# EAGLE design tracker (EAGLE 6.5.0)
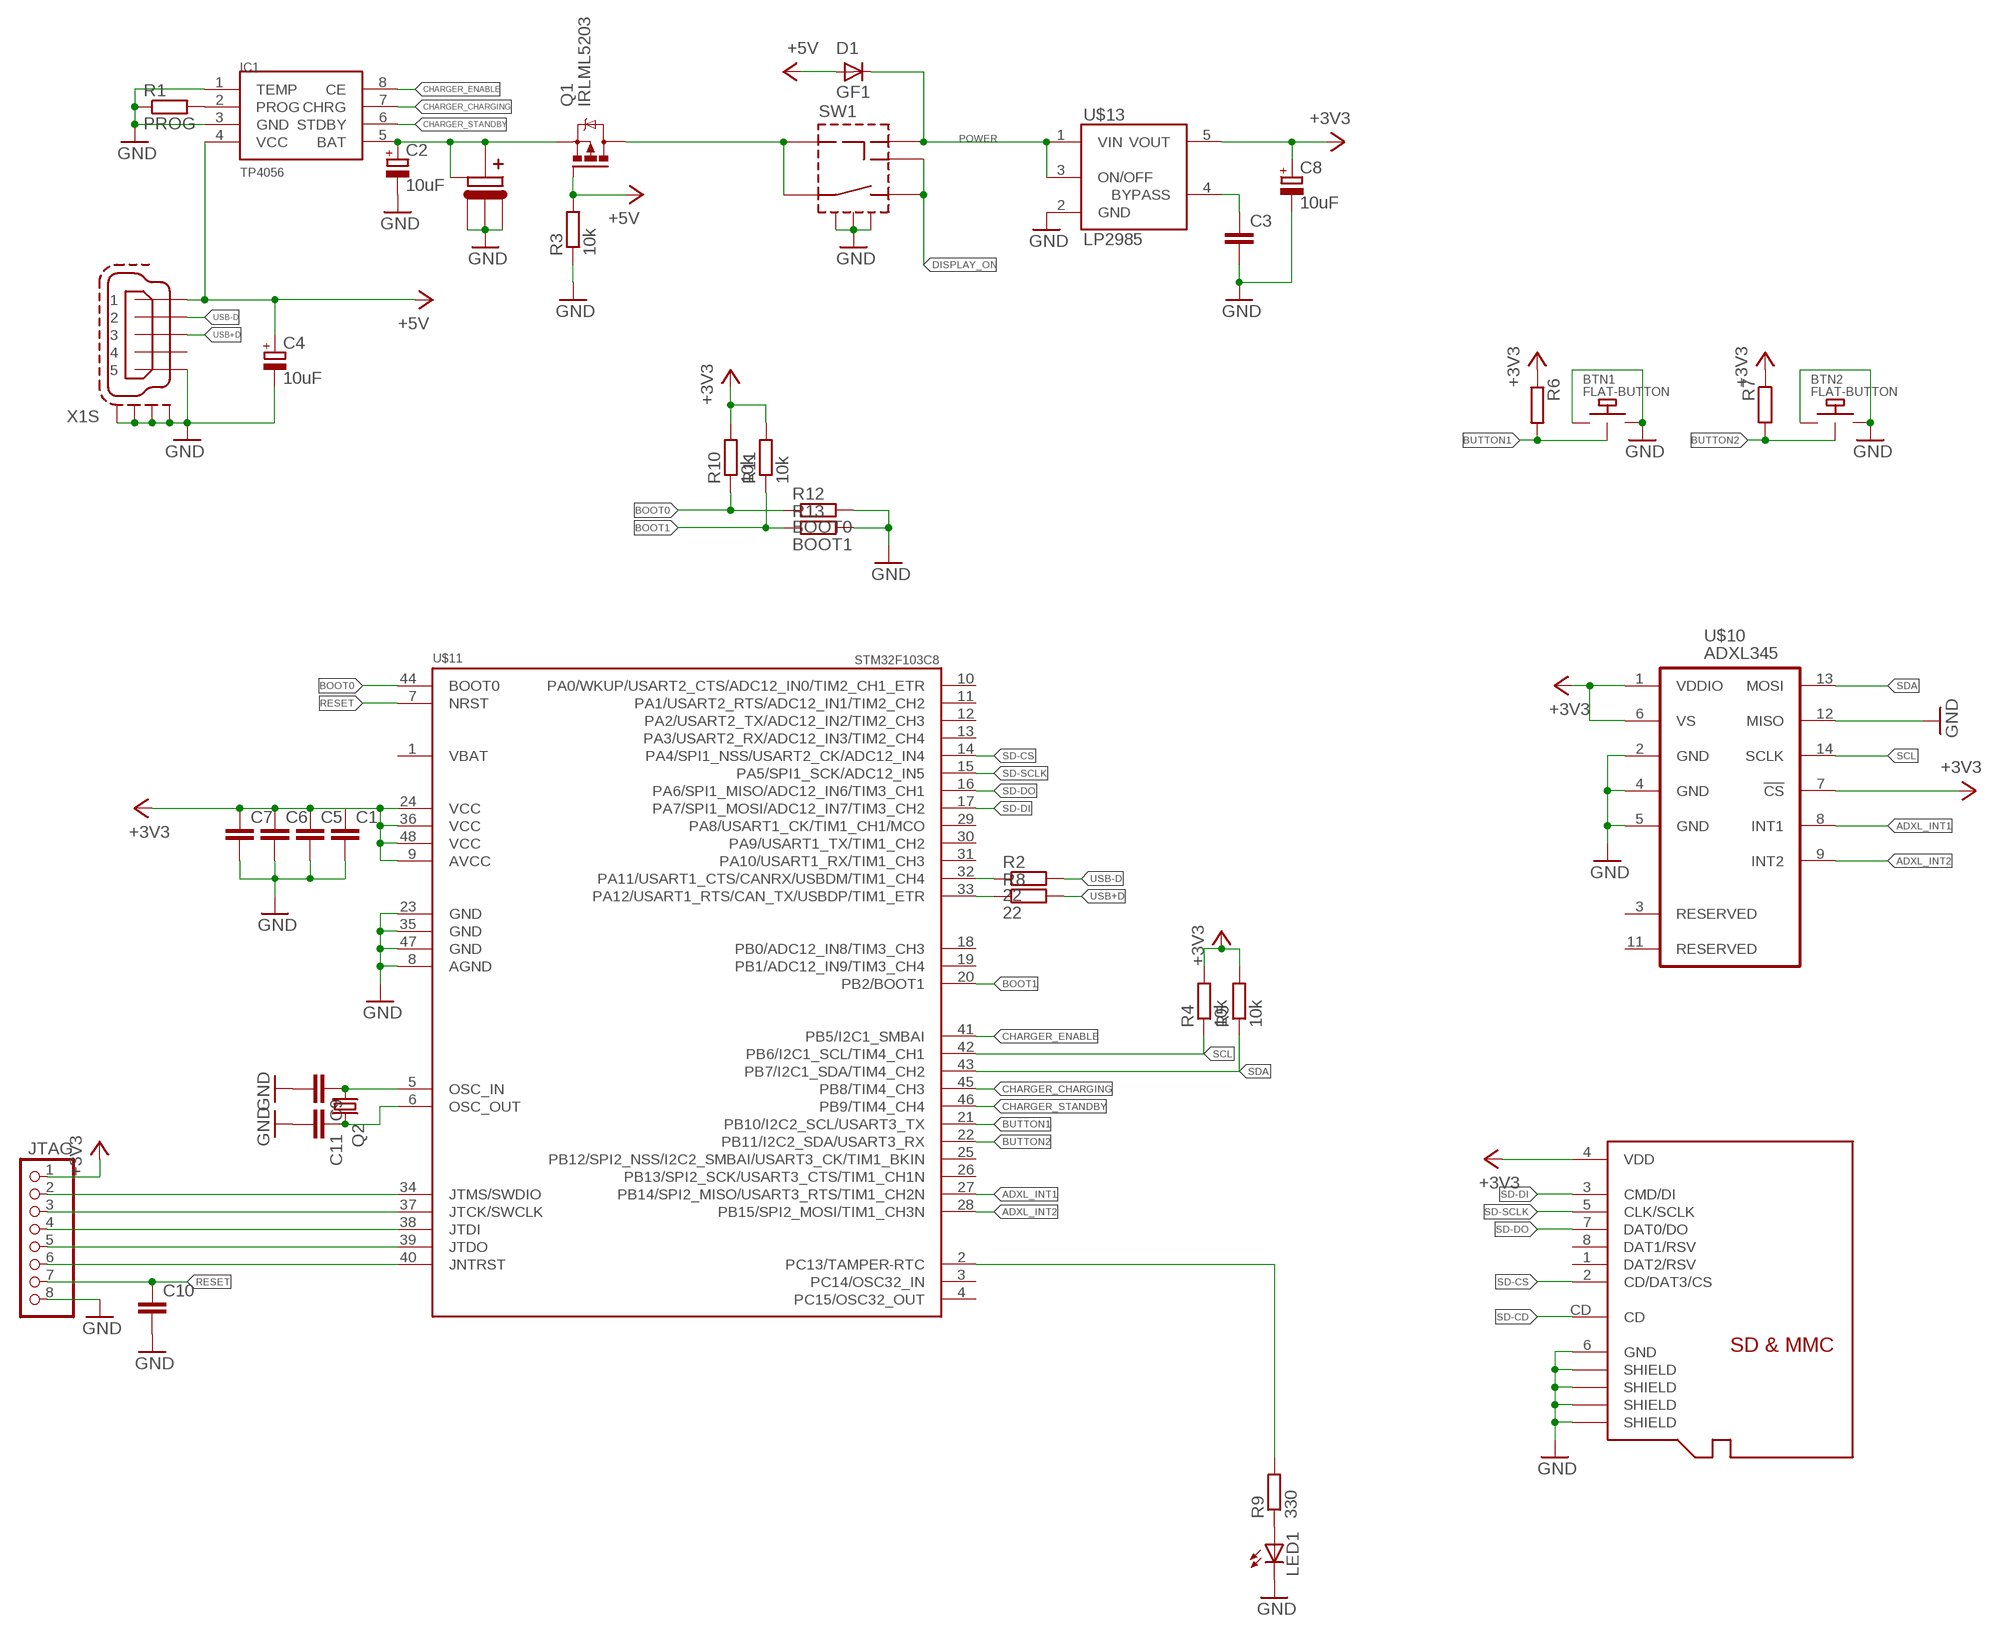
[diagram p0: schematic, sheet 1]

## Parts
BTN1  FLAT-BUTTON  [FLAT-BUTTON]
BTN2  FLAT-BUTTON  [FLAT-BUTTON]
C1  C-EUC0805K  [C0805K]
C2  10uF  CPOL-EUB/3528-21W  [B/3528-21W]
C3  C-EUC0805K  [C0805K]
C4  10uF  CPOL-EUB/3528-21W  [B/3528-21W]
C5  C-EUC0805K  [C0805K]
C6  C-EUC0805K  [C0805K]
C7  C-EUC0805K  [C0805K]
C8  10uF  CPOL-EUB/3528-21W  [B/3528-21W]
C9  C-EUC0805K  [C0805K]
C10  C-EUC0805K  [C0805K]
C11  C-EUC0805K  [C0805K]
D1  GF1  [SMA-DO214AC]
IC1  TP4056  [SOP-8]
JTAG  PINHD-1X8  [PLL1.27-1X8]
LED1  LEDSML1206  [SML1206]
Q1  IRLML5203  [MICRO3]
Q2  CRYSTALHC49S  [HC49/S]
R1  PROG  R-EU_M0805  [M0805]
R2  22  R-EU_R0805  [R0805]
R3  10k  R-EU_R0805  [R0805]
R4  10k  R-EU_R0805  [R0805]
R5  10k  R-EU_R0805  [R0805]
R6  R-EU_R0805  [R0805]
R7  R-EU_R0805  [R0805]
R8  22  R-EU_R0805  [R0805]
R9  330  R-EU_R0805  [R0805]
R10  10k  R-EU_R0805  [R0805]
R11  10k  R-EU_R0805  [R0805]
R12  BOOT0  R-EU_R0805  [R0805]
R13  BOOT1  R-EU_R0805  [R0805]
SW1  PWR-SWITCH  [PWR-SWITCH]
U$6  BATTERY+  [BATTERY+]
U$7  BATTERY-  [BATTERY-]
U$10  ADXL345  [LGA14]
U$11  STM32F103C8  [LQFP48-7X7]
U$12  MICROSD  [C12075]
U$13  LP2985AIM5-3.3  [SOT25]
X1  MINI-USB-SCHIELD-32005-301  [32005-301]

## Nets
+3V3 [VCC]: C1.1 C5.1 C6.1 C7.1 C8.+ JTAG.1 R4.2 R5.2 R6.1 R7.1 R10.2 R11.2 U$10.1(VDDIO) U$10.6(VS) U$10.7(!CS) U$11.9(AVCC) U$11.24(VCC) U$11.36(VCC) U$11.48(VCC) U$12.4(VDD) U$13.5(VOUT)
+5V [POWER]: C4.+ D1.A IC1.4(VCC) Q1.1(G) R3.2 X1.1
ADXL_INT1: U$10.8(INT1) U$11.27(PB14/SPI2_MISO/USART3_RTS/TIM1_CH2N)
ADXL_INT2: U$10.9(INT2) U$11.28(PB15/SPI2_MOSI/TIM1_CH3N)
BAT+ [BAT+]: C2.+ IC1.5(BAT) Q1.2(S) U$6.PAD(BATTERY+#1) U$6.PIN(BATTERY+#2)
BAT-PROG [BAT+]: IC1.2(PROG) R1.2
BOOT0: R10.1 R12.1 U$11.44(BOOT0)
BOOT1: R11.1 R13.1 U$11.20(PB2/BOOT1)
BUTTON1: BTN1.1 R6.2 U$11.21(PB10/I2C2_SCL/USART3_TX)
BUTTON2: BTN2.1 R7.2 U$11.22(PB11/I2C2_SDA/USART3_RX)
BYPASS: C3.1 U$13.4(BYPASS)
CHARGER_CHARGING: IC1.7(CHRG) U$11.45(PB8/TIM4_CH3)
CHARGER_ENABLE: IC1.8(CE) U$11.41(PB5/I2C1_SMBAI)
CHARGER_STANDBY: IC1.6(STDBY) U$11.46(PB9/TIM4_CH4)
DISPLAY_ON: SW1.4(BTN2) SW1.5(PWR-OUT2)
GND [GND]: BTN1.2 BTN1.3 BTN2.2 BTN2.3 C1.2 C2.- C3.2 C4.- C5.2 C6.2 C7.2 C8.- C9.2 C10.2 C11.2 IC1.1(TEMP) IC1.3(GND) JTAG.8 LED1.C R1.1 R3.1 R12.2 R13.2 SW1.SCREEN@1(SHIELD) SW1.SCREEN@2(SHIELD) SW1.SCREEN@3(SHIELD) U$7.P$1(BATTERY-) U$7.P$2(BATTERY-) U$7.P$3(BATTERY-) U$10.2(GND) U$10.4(GND) U$10.5(GND) U$10.12(MISO) U$11.8(AGND) U$11.23(GND) U$11.35(GND) U$11.47(GND) U$12.6(GND) U$12.GND@1(SHIELD) U$12.GND@2(SHIELD) U$12.GND@3(SHIELD) U$12.GND@4(SHIELD) U$13.2(GND) X1.5 X1.M1(S:S1) X1.M2(S:S2) X1.M3(S:S3) X1.M4(S:S4)
N$1 [BAT+]: Q1.3(D) SW1.1(BTN1) SW1.2(PWR-IN)
N$2: C9.1 Q2.1 U$11.5(OSC_IN)
N$3: C11.1 Q2.2 U$11.6(OSC_OUT)
N$4: R2.1 U$11.32(PA11/USART1_CTS/CANRX/USBDM/TIM1_CH4)
N$5: R8.1 U$11.33(PA12/USART1_RTS/CAN_TX/USBDP/TIM1_ETR)
N$6: LED1.A R9.1
N$7: JTAG.2 U$11.34(JTMS/SWDIO)
N$8: R9.2 U$11.2(PC13/TAMPER-RTC)
N$13: JTAG.3 U$11.37(JTCK/SWCLK)
N$16: JTAG.4 U$11.38(JTDI)
N$17: JTAG.5 U$11.39(JTDO)
N$18: JTAG.6 U$11.40(JNTRST)
POWER [POWER]: D1.K(C) SW1.3(PWR-OUT1) U$13.1(VIN) U$13.3(ON/OFF)
RESET: C10.1 JTAG.7 U$11.7(NRST)
SCL: R4.1 U$10.14(SCLK) U$11.42(PB6/I2C1_SCL/TIM4_CH1)
SD-CD: U$12.CD
SD-CS: U$11.14(PA4/SPI1_NSS/USART2_CK/ADC12_IN4) U$12.2(CD/DAT3/CS)
SD-DI: U$11.17(PA7/SPI1_MOSI/ADC12_IN7/TIM3_CH2) U$12.3(CMD/DI)
SD-DO: U$11.16(PA6/SPI1_MISO/ADC12_IN6/TIM3_CH1) U$12.7(DAT0/DO)
SD-SCLK: U$11.15(PA5/SPI1_SCK/ADC12_IN5) U$12.5(CLK/SCLK)
SDA: R5.1 U$10.13(MOSI) U$11.43(PB7/I2C1_SDA/TIM4_CH2)
USB+D: R8.2 X1.3
USB-D: R2.2 X1.2
Unconnected: U$10.3(RESERVED) U$10.10(NC) U$10.11(RESERVED) U$11.3(PC14/OSC32_IN) U$11.4(PC15/OSC32_OUT) U$11.10(PA0/WKUP/USART2_CTS/ADC12_IN0/TIM2_CH1_ETR) U$11.11(PA1/USART2_RTS/ADC12_IN1/TIM2_CH2) U$11.12(PA2/USART2_TX/ADC12_IN2/TIM2_CH3) U$11.13(PA3/USART2_RX/ADC12_IN3/TIM2_CH4) U$11.18(PB0/ADC12_IN8/TIM3_CH3) U$11.19(PB1/ADC12_IN9/TIM3_CH4) U$11.25(PB12/SPI2_NSS/I2C2_SMBAI/USART3_CK/TIM1_BKIN) U$11.26(PB13/SPI2_SCK/USART3_CTS/TIM1_CH1N) U$11.29(PA8/USART1_CK/TIM1_CH1/MCO) U$11.30(PA9/USART1_TX/TIM1_CH2) U$11.31(PA10/USART1_RX/TIM1_CH3) U$12.1(DAT2/RSV) U$12.8(DAT1/RSV) X1.4

## Power pins joined to a net without a drawn wire
VBAT: U$11.1(VBAT)

## Library data of the parts
BTN1 BTN2 = ml:FLAT-BUTTON
C1 C3 C5-C7 C9-C11 = resistor:C-EU: CAPACITOR, European symbol
C2 C4 C8 = resistor:CPOL-EU: POLARIZED CAPACITOR, European symbol
D1 = diode:GF1: DIODE
IC1 = TP4056:TP4056
JTAG = PLL:PINHD-1X8: PIN HEADER
LED1 = led:LED: LED OSRAM: - CHIPLED LG R971, LG N971, LY N971, LG Q971, LY Q971, LO R971, LY R971 LH N974, LH R974 LS Q976, LO Q976, LY Q976 LO Q996 - Hyper CHIPLED LW Q18S LB Q993, LB Q99A, LB R99A - SideLED LS A670, LO A670, LY A670, LG A670, LP A670 LB A673, LV A673, LT A673, LW A673 LH A674 LY A675 LS A676, LA A676, LO A676, LY A676, LW A676 LS A679, LY A679, LG A679 - Hyper Micro SIDELED® LS Y876, LA Y876, LO Y876, LY Y876 LT Y87S - SmartLED LW L88C, LW L88S LB L89C, LB L89S, LG L890 LS L89K, LO L89K, LY L89K LS L896, LA L896, LO L896, LY L896 - TOPLED LS T670, LO T670, LY T670, LG T670, LP T670 LSG T670, LSP T670, LSY T670, LOP T670, LYG T670 LG T671, LOG T671, LSG T671 LB T673, LV T673, LT T673, LW T673 LH T674 LS T676, LA T676, LO T676, LY T676, LB T676, LH T676, LSB T676, LW T676 LB T67C, LV T67C, LT T67C, LS T67K, LO T67K, LY T67K, LW E67C LS E67B, LA E67B, LO E67B, LY E67B, LB E67C, LV E67C, LT E67C LW T67C LS T679, LY T679, LG T679 LS T770, LO T770, LY T770, LG T770, LP T770 LB T773, LV T773, LT T773, LW T773 LH T774 LS E675, LA E675, LY E675, LS T675 LS T776, LA T776, LO T776, LY T776, LB T776 LHGB T686 LT T68C, LB T68C - Hyper Mini TOPLED® LB M676 - Mini TOPLED Santana® LG M470 LS M47K, LO M47K, LY M47K Source: http://www.osram.convergy.de LUXEON: - LUMILED® LXK2-PW12-R00, LXK2-PW12-S00, LXK2-PW14-U00, LXK2-PW14-V00 LXK2-PM12-R00, LXK2-PM12-S00, LXK2-PM14-U00 LXK2-PE12-Q00, LXK2-PE12-R00, LXK2-PE12-S00, LXK2-PE14-T00, LXK2-PE14-U00 LXK2-PB12-K00, LXK2-PB12-L00, LXK2-PB12-M00, LXK2-PB14-N00, LXK2-PB14-P00, LXK2-PB14-Q00 LXK2-PR12-L00, LXK2-PR12-M00, LXK2-PR14-Q00, LXK2-PR14-R00 LXK2-PD12-Q00, LXK2-PD12-R00, LXK2-PD12-S00 LXK2-PH12-R00, LXK2-PH12-S00 LXK2-PL12-P00, LXK2-PL12-Q00, LXK2-PL12-R00 Source: www.luxeon.com KINGBRIGHT: KA-3528ASYC Source: www.kingbright.com
Q1 = transistor-power:IRLML5203: HEXFET P-Channel Power MOSFET
Q2 = crystal:CRYSTAL: CRYSTAL; OC_FARNELL: 1667008; OC_NEWARK: unknown
R1-R13 = resistor:R-EU_: RESISTOR, European symbol
SW1 = ml:PWR-SWITCH
U$6 = ml:BATTERY+
U$7 = ml:BATTERY-
U$10 = adxl345:ADXL345: 3-Axis, ±2 g/±4 g/±8 g/±16 g Digital Accelerometer
U$11 = stm32:STM32F103C8
U$12 = micro-sd:MICROSD: Micro-SD / Transflash card holder with SPI pinout For the 3M # 2908-05WB-MG and/or 4UCON #19656 push-push type
U$13 = LP2985:LP2985: LP2985-N Micropower 150 mA Low-Noise Ultra Low-Dropout Regulator
X1 = con-cypressindustries:MINI-USB-SCHIELD-: MINI USB-B Conector Source: www.cypressindustries.com; OC_FARNELL: unknown; OC_NEWARK: unknown

## Net classes
1 GND: width 0.5 mm
2 POWER: width 0.4 mm
3 VCC: width 0.4 mm
4 BAT+: width 0.5 mm

## Board
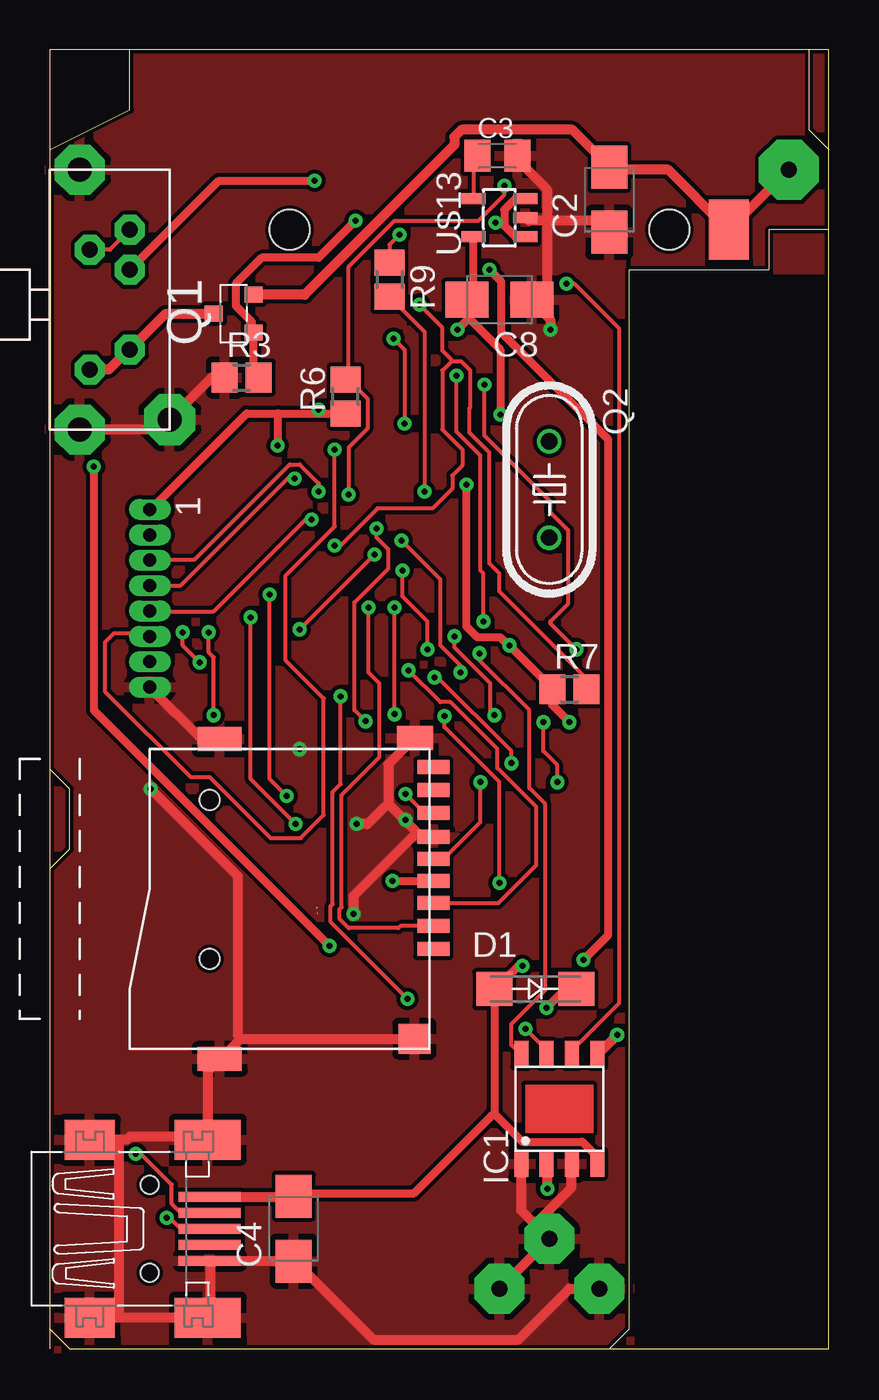
[diagram p1: board, top side]
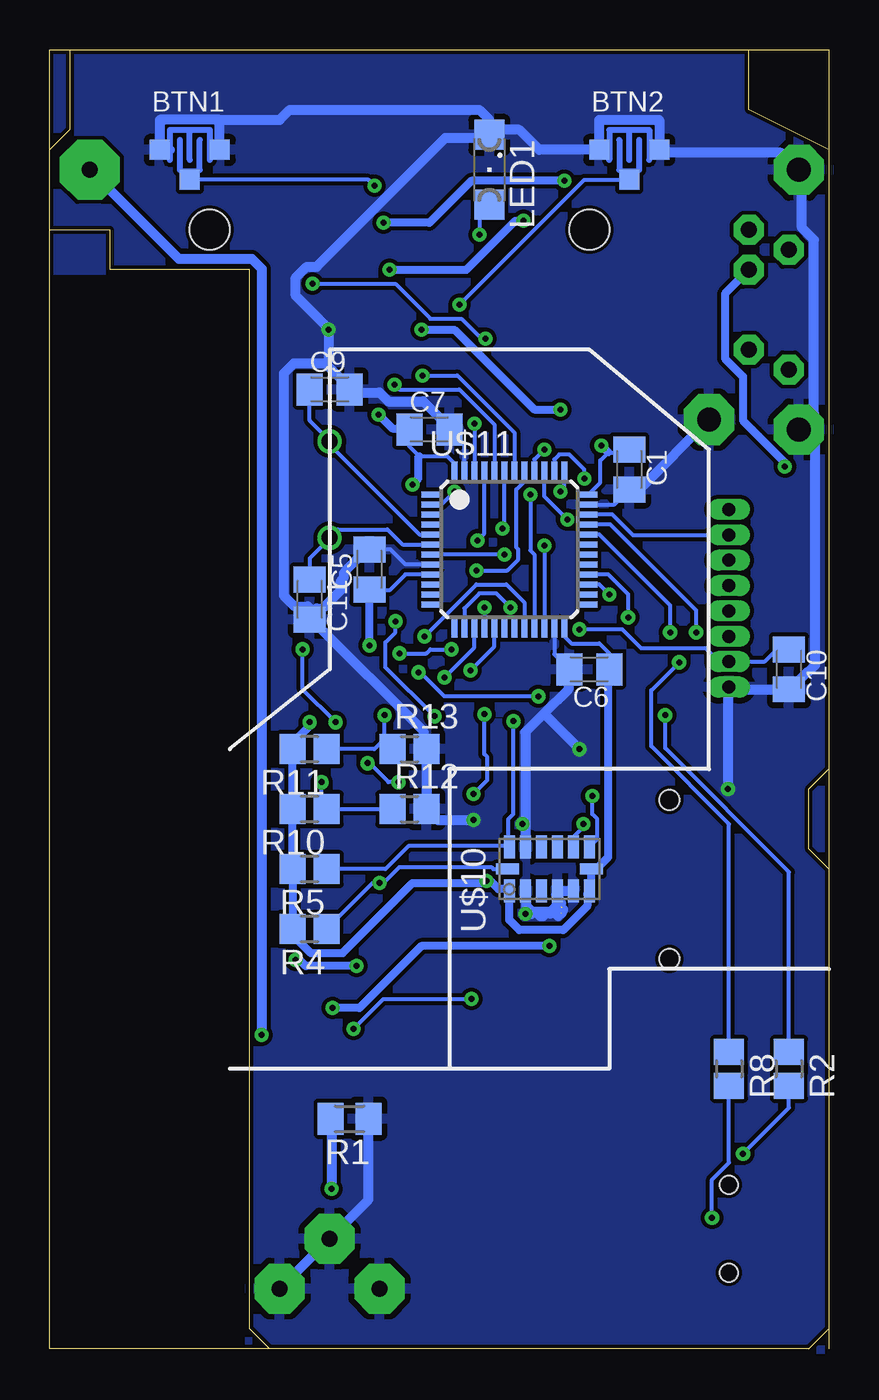
[diagram p2: board, bottom side, seen from below]

Size 39 x 65 mm. Coordinates in mm from the lower left corner, seen from the top.
Outline: 28,0 1,0 0,1
Outline: 28,0 39,0 39,65 38,65
Outline: 38,65 4,65
Outline: 4,65 0,65 0,60
Outline: 0,60 0,29
Outline: 0,29 0,24
Outline: 0,24 0,1
Outline: 0,1 0,0
Outline: 28,0 29,1 29,54 36,54 36,56 39,56 39,60 38,61 38,65
Outline: 0,24 1,25 1,28 0,29
Outline: 0,60 4,62 4,65
Copper layers (1*16): Top 0.035mm / dielectric 1mm / Bottom 0.035mm
Design rules "default *": minimum track width 8mil, minimum drill 0.3mm, track to track 8mil, track to pad 8mil, pad to pad 8mil, via to via 8mil, smd to smd 0mil, copper to edge 0.2mm, drill to drill 1mm, minimum pad ring 8mil, minimum via ring 8mil, stop-mask expansion 4mil, vias tented up to drill 0mil, thermal gap 0.3mm
Holes 2 mm at 12,56 31,56

### Footprints (pad centres in the part's own frame; a part is rotated, then mirrored left to right if it is on the bottom)
FLAT-BUTTON = smd 1 x 1: 1 0,-1.5; 2 -1.5,0; 3 1.5,0
C0805K = smd 1.3 x 1.6: 1 -1,0; 2 1,0
B/3528-21W = smd 2.15 x 1.8: + 1.625,0; - -1.625,0
SMA-DO214AC = smd 1.8 x 1.7: A -2.05,0; K 2.05,0
SOP-8 = smd 1.3 x 0.7: 1 -2.75,1.905; 2 -2.75,0.635; 3 -2.75,-0.635; 4 -2.75,-1.905; 5 2.75,-1.905; 6 2.75,-0.635; 7 2.75,0.635; 8 2.75,1.905
PLL1.27-1X8 = drill 0.65 pad 1.016 long: 1 0,0; 2 1.27,0; 3 2.54,0; 4 3.81,0; 5 5.08,0; 6 6.35,0; 7 7.62,0; 8 8.89,0
SML1206 = smd 1.5 x 1.5: A 1.75,0; C -1.75,0
MICRO3 = smd 0.8 x 0.9: 1 -0.95,-1; 2 0.95,-1; 3 0,1
HC49/S = drill 0.813: 1 -2.413,0; 2 2.413,0
M0805 = smd 1.3 x 1.6: 1 -0.95,0; 2 0.95,0
R0805 = smd 1.3 x 1.5: 1 -0.85,0; 2 0.85,0
PWR-SWITCH = drill 0.8 pad 1.5 octagon: 1 3,4; 2 4,2; 3 8,2; 4 9,4; 5 10,2 | drill 1.2 pad 2.5 octagon: SCREEN@1 0,4.5; SCREEN@3 13,4.5 | drill 1.2 pad 2.54 octagon: SCREEN@2 0.5,0
BATTERY+ = smd 2 x 3: PAD -3,-3 | drill 0.8 pad 3 octagon: PIN 0,0
BATTERY- = drill 0.8 pad 2.5 octagon: P$1 0,2.5; P$2 2.5,0; P$3 -2.5,0
LGA14 = smd 1.15 x 0.55: 1 -1.1,2; 2 -1.1,1.2; 3 -1.1,0.4; 4 -1.1,-0.4; 5 -1.1,-1.2; 6 -1.1,-2; 8 1.1,-2; 9 1.1,-1.2; 10 1.1,-0.4; 11 1.1,0.4; 12 1.1,1.2; 13 1.1,2 | smd 0.55 x 1.15: 7 0,-2.1; 14 0,2.1
LQFP48-7X7 = smd 0.9 x 0.3: 1 -3.95,2.75; 2 -3.95,2.25; 3 -3.95,1.75; 4 -3.95,1.25; 5 -3.95,0.75; 6 -3.95,0.25; 7 -3.95,-0.25; 8 -3.95,-0.75; 9 -3.95,-1.25; 10 -3.95,-1.75; 11 -3.95,-2.25; 12 -3.95,-2.75; 25 3.95,-2.75; 26 3.95,-2.25; 27 3.95,-1.75; 28 3.95,-1.25; 29 3.95,-0.75; 30 3.95,-0.25; 31 3.95,0.25; 32 3.95,0.75; 33 3.95,1.25; 34 3.95,1.75; 35 3.95,2.25; 36 3.95,2.75 | smd 0.3 x 0.9: 13 -2.75,-3.95; 14 -2.25,-3.95; 15 -1.75,-3.95; 16 -1.25,-3.95; 17 -0.75,-3.95; 18 -0.25,-3.95; 19 0.25,-3.95; 20 0.75,-3.95; 21 1.25,-3.95; 22 1.75,-3.95; 23 2.25,-3.95; 24 2.75,-3.95; 37 2.75,3.95; 38 2.25,3.95; 39 1.75,3.95; 40 1.25,3.95; 41 0.75,3.95; 42 0.25,3.95; 43 -0.25,3.95; 44 -0.75,3.95; 45 -1.25,3.95; 46 -1.75,3.95; 47 -2.25,3.95; 48 -2.75,3.95
C12075 = smd 0.7 x 1.6: 1 2.5,7.7; 2 1.35,7.7; 3 0.2,7.7; 4 -0.9,7.7; 5 -2,7.7; 6 -3.1,7.7; 7 -4.3,7.7; 8 -5.45,7.7; CD -6.6,7.7 | smd 1.2 x 1.8: GND@1 -8.05,6.77 | smd 1.2 x 2.2: GND@2 -8,-3; GND@4 8,-3 | smd 1.5 x 1.6: GND@3 6.99,6.75 | hole 1: -4.95,-3.5; 3,-3.5; 3,-3.5
SOT25 = smd 0.55 x 1.2: 1 -0.95,-1.3; 2 0,-1.3; 3 0.95,-1.3; 4 0.95,1.3; 5 -0.95,1.3
32005-301 = smd 3.1 x 0.5: 1 3,1.6; 2 3,0.8; 3 3,0; 4 3,-0.8; 5 3,-1.6 | smd 2.5 x 2: M1 -3,-4.45; M2 -3,4.45 | smd 3.3 x 2: M3 2.9,4.45; M4 2.9,-4.45 | hole 0.9: 0,2.2; 0,-2.2

### Placement (x,y rotation side)
BTN1  32,60 0 bottom
BTN2  10,60 0 bottom
C1  10,44 270 bottom
C2  28,57.5 90 top
C3  22.4,59.7 0 top
C4  12.2,6 90 top
C5  23,39 90 bottom
C6  12,34 180 bottom
C7  20,46 0 bottom
C8  22.5,52.5 180 top
C9  25,48 0 bottom
C10  2,34 270 bottom
C11  26,37.5 270 bottom
D1  24.3,18 0 top
IC1  25.5,12 90 top
JTAG  5,42 270 top
LED1  17,59 270 bottom
Q1  9.2,51.8 90 top
Q2  25,43 270 top
R1  24,11.5 180 bottom
R2  2,14 270 bottom
R3  9.6,48.6 0 top
R4  26,21 180 bottom
R5  26,24 180 bottom
R6  14.8,47.65 90 top
R7  26,33 0 top
R8  5,14 270 bottom
R9  17,53.5 270 top
R10  26,27 180 bottom
R11  26,30 180 bottom
R12  21,27 0 bottom
R13  21,30 0 bottom
SW1  6,46 90 top
U$6  37,59 0 top
U$7  25,3 0 top
U$10  14,24 90 bottom
U$11  16,40 0 bottom
U$12  11.5,22.5 270 top
U$13  22.5,56.6 90 top
X1  5,6 0 top

### Tracks (layer width: path | path; a pad name or v marks a point on that pad's centre or on a via)
+3V3  (via drill 0.3)
  Top 0.4: v17.15,23.4 U$12.4 | 11.4,46.8 9.85,46.8 5.05,42 JTAG.1 | 11.4,46.8 13.45,46.8 | 13.45,46.8 R6.1 | 11.4,46.8 v11.4,45.2 | U$13.5 21.2,52.8 20.9,52.5 C8.+ 21,52.35 21,51.55 | v22.55,46.75 22.55,50 21,51.55 | v26,31.35 25.15,32.2 R7.1 25.05,33.15 v23,35.2 22.85,35.3 22.55,35.6 21.4,35.6 20.85,36.15 v20.85,43.25 | v20.4,51 20.85,51.45 21,51.55 | v13.45,47 13.45,46.8
  Bottom 0.2: U$11.48 18.75,44.3 19.1,44.65 20.5,44.65 21,45.15 C7.1 | U$11.36 11.45,43.35 11.45,44.45 11.05,44.85 10.15,44.85 C1.1 | U$11.9 21.2,38.75 22,37.95 22.95,37.95 C5.1 | U$11.24 13.25,35.65 12.9,35.3 11.5,35.3 11,34.8 C6.1
  Bottom 0.4: C6.1 11.05,33.95 11.05,24.6 11.55,24.1 11.75,24.1 U$10.7 11.9,23 U$10.6 12.1,22.75 12.1,22.15 13.3,20.95 15.5,20.95 16,21.45 U$10.1 16.15,23 16.55,23 16.95,23.4 v17.15,23.4 17.3,23.3 20.85,23.3 24.35,19.8 25.95,19.8 26.75,20.6 26.75,20.85 R4.2 R5.2 R10.2 R11.2 26.75,30.15 26.75,30.4 26,31.15 v26,31.35 | v11.4,45.2 11.05,44.85 | v22.55,46.75 21.85,46.05 21.05,46.05 C7.1 | v23,35.2 C5.1 | v20.85,43.25 20.55,43.55 20.55,44.6 20.5,44.65 | v13.45,47 14.75,47 18.75,51 v20.4,51
+5V  (via drill 0.3)
  Top 0.4: R3.2 10.2,48.85 Q1.1 10.1,51 10.1,51.4 9.3,52.2 9.3,53.3 10.6,54.6 13.45,54.6 v15.3,56.45 | 22.25,11.75 23.65,10.35 26.65,10.35 27.4,9.6 IC1.4 | 22.25,11.75 D1.A 22.4,18.1 23.45,19.15 v23.65,19.15 | v22,54 22.6,53.4 22.6,50.85 27.95,45.5 27.95,20.7 v26.7,19.45 | C4.+ 12.4,7.75 18.2,7.75 22.1,11.65 22.25,11.75
  Top 0.5: X1.1 12.18,7.6 C4.+
  Bottom 0.4: v15.3,56.45 15.7,56.45 18.15,54 v22,54 | v26.7,19.45 26.5,19.45 26.2,19.15 v23.65,19.15
ADXL_INT1  (via drill 0.3)
  Top 0.203: v11,37.75 11,28.5 v11.85,27.65
  Bottom 0.203: U$11.27 11.5,38.25 v11,37.75 | v11.85,27.65 11.85,26.75 11.6,26.5 11.6,25.5 U$10.8
ADXL_INT2  (via drill 0.3)
  Top 0.203: v10.05,36.6 10.05,28.5 v12.3,26.25
  Bottom 0.203: U$11.28 11.05,38.75 10.05,37.75 v10.05,36.6 | v12.3,26.25 12.3,26.1 12.8,25.6 U$10.9
BAT+  (via drill 0.3)
  Top 0.5: v28.4,15.7 27.45,14.75 IC1.5 | U$6.PIN U$6.PAD 33.8,56.15 30.95,59 28.2,59 C2.+ 28,59.15 26.15,61 20.6,61 20.25,60.65 20.25,60.25 12.75,52.75 Q1.2
  Bottom 0.5: v28.4,15.7 28.4,54.05 28.9,54.55 32.55,54.55 U$6.PIN
BAT-PROG  (via drill 0.3)
  Top 0.5: v24.9,8 24.9,9.25 IC1.2
  Bottom 0.5: v24.9,8 24.9,11.45 R1.2
BOOT0  (via drill 0.3)
  Top 0.203: v21.75,48.25 21.75,45.7 25.05,42.4 25.05,41.85 25.95,40.95 25.95,37.3 25.05,36.4 25.05,36.3 v26.35,35 | v24.7,31.35 24.7,29.9 25.4,29.2 v25.4,28.35
  Bottom 0.203: U$11.44 16.75,46.25 18.5,48 21.5,48 v21.75,48.25 | v26.35,35 26.35,33 v24.7,31.35 | v25.4,28.35 25.4,27.25 R10.1 R12.1
BOOT1  (via drill 0.3)
  Top 0.203: v20.25,35.65 20.25,35.1 22.05,33.3 22.05,31.9 v22.25,31.7
  Bottom 0.203: U$11.20 15.25,37.35 16.15,38.25 17.65,38.25 v20.25,35.65 | v22.25,31.7 22.25,30.4 R13.1 22.35,30.4 22.75,30 R11.1
BUTTON1  (via drill 0.3)
  Top 0.203: v14.95,42.75 14.95,45.1 15.9,46.05 15.9,47.55 14.95,48.5 R6.2 14.95,48.6 14.95,54.15 17.25,56.45 21.45,56.45 22.75,57.75 v22.75,58.2
  Bottom 0.203: U$11.21 14.75,39.75 14.95,39.95 v14.95,42.75 | BTN1.1 23.05,58.5 v22.75,58.2
BUTTON2  (via drill 0.3)
  Top 0.203: v14.25,40.2 14.55,40.2 16.4,42.05 19.15,42.05 20.15,43.05 20.15,43.7 20.65,44.2 20.65,45 19.65,46 19.65,48.95 20.1,49.4 | 20.1,49.4 20.6,49.4 21.05,48.95 21.05,47.1 21,47.05 21,45.85 22,44.85 22,39.3 22.5,38.8 22.5,37.9 26.85,33.55 R7.2 | v18.5,52.25 19.65,51.1 19.65,49.95 20.1,49.5 20.1,49.4
  Bottom 0.203: v14.25,40.2 U$11.22 | BTN2.1 12.25,58.5 v18.5,52.25
BYPASS
  Top 0.203: U$13.4 21.2,59.5 C3.1
CHARGER_CHARGING  (via drill 0.3)
  Top 0.203: v17.6,40.45 19.55,38.5 19.55,35.2 20.55,34.2 v20.55,33.85 | v14.55,32.65 14.55,28.25 14.15,27.85 14.15,22.25 14.05,22.15 14.05,21.35 v17.9,17.5 | v23.8,16 24.85,14.95 IC1.7
  Bottom 0.203: U$11.45 17.25,40.8 v17.6,40.45 | v20.55,33.85 20.45,33.85 19.25,32.65 v14.55,32.65 | v17.9,17.5 22.3,17.5 v23.8,16
CHARGER_ENABLE  (via drill 0.3)
  Top 0.203: v17.65,38.95 17.65,37.65 18.9,36.4 v18.9,35 | v21.5,34.8 21.5,34.45 24,31.95 24,28.05 24.8,27.25 24.8,17.95 23.1,16.25 23.1,15.2 23.55,14.75 IC1.8
  Bottom 0.203: U$11.41 15.25,43.4 15.65,43 15.65,40.1 15.55,40 15.55,39.5 16.1,38.95 v17.65,38.95 | v18.9,35 19.95,35 20.15,34.8 v21.5,34.8
CHARGER_STANDBY  (via drill 0.3)
  Top 0.203: v17.75,46.3 17.75,50 v17.2,50.55 | v25.85,53.3 26.25,53.3 28.5,51.05 28.5,17.3 26.15,14.95 IC1.6
  Bottom 0.203: v17.75,46.3 U$11.46 | v17.2,50.55 17.4,50.55 18.4,51.55 19.95,51.55 21.7,53.3 v25.85,53.3
DISPLAY_ON
  Top 0.203: SW1.4 3,55 SW1.5
GND  (via drill 0.3)  (2 unrouted)
  Top 0.5: 8.03,4.38 C4.- 12.4,4.25 16.2,0.45 23.45,0.45 26,3 U$7.P$2 | 8.03,4.38 X1.5 | 16.95,27.25 17.77,26.43 | 17.77,26.43 18.38,25.82 | 18.38,25.82 18.45,25.75 19,25.75 U$12.6 | 16.95,27.25 16.95,29.25 18.25,30.55 U$12.GND@1 | v15.2,21.75 15.2,22.65 18.38,25.82 | v15.35,26.25 15.9,26.25 16.75,27.1 16.95,27.25 | v17.8,26.45 17.77,26.43 | U$7.P$1 23.6,6.9 IC1.1 | IC1.3 26.1,9.25 26.1,8.05 24.45,6.4 U$7.P$1 | U$7.P$1 U$7.P$3 | 3.45,1.55 X1.M4 8.05,1.75 8.05,4.15 8.03,4.38 | 3.45,1.55 X1.M1 | 3.45,10.45 3.85,10.45 4,10.6 7.75,10.6 X1.M3 7.9,13.85 8.35,14.3 U$12.GND@4 8.7,14.65 9.55,15.5 | 3.45,10.45 X1.M2 | 3.45,10.45 3.45,1.55 | U$12.GND@2 7.6,30.5 JTAG.8 | R3.1 8.1,48.6 SW1.SCREEN@2 5.8,46.35 5.45,46 SW1.SCREEN@1 | 24.9,56.45 27.45,56.45 28,55.9 C2.- | 24.9,56.45 24,56.45 U$13.2 | C3.2 23.4,59.5 24.9,58 24.9,56.45 | 24.9,56.45 24.9,53.35 24.25,52.7 C8.- 24.25,52.3 25.05,51.5 v25.05,51 | 9.55,15.5 U$12.GND@3 | v5.05,28 9.4,23.65 9.4,15.7 9.55,15.5
  Bottom 0.2: U$11.47 18.25,45.25 C7.2 | U$11.35 10.75,42.25 C1.2 | U$11.8 21.2,39.25 21.95,40 C5.2 | U$11.23 13.75,34.75 C6.2
  Bottom 0.5: 15.2,26.25 15.2,30.85 14.28,31.77 | 15.2,26.25 U$10.12 | 14.28,31.77 13.05,33 13.05,33.95 C6.2 | U$10.4 U$10.5 | 14.95,21.95 14.85,21.85 14.15,21.85 | 14.95,21.95 14.97,21.98 | 14.97,21.98 15.15,22.15 15.15,22.7 U$10.2 | 13.95,21.85 14,21.85 | 14,21.85 14.1,21.85 | 14.1,21.85 14.15,21.85 | 13.8,22 13.65,22.15 13.65,22.7 U$10.4 | 13.8,22 13.85,21.95 | 13.85,21.95 13.95,21.85 | 15.05,21.9 14.97,21.98 | v15.35,26.25 15.2,26.25 | C11.2 25.9,37 26.1,37.15 26.75,37.15 27.3,37.7 27.3,48.8 26.8,49.3 25.2,49.3 | 23.05,40.05 C5.2 23.25,39.9 24.15,39 24.3,38.8 24.3,38.6 24.45,38.4 24.45,37.95 25.35,37.05 25.65,37.05 C11.2 | v17.8,26.45 19.55,26.45 19.95,26.85 R12.2 R13.2 20.3,30.2 20.3,30.9 25.8,36.4 C11.2 | R1.1 23.05,7.45 U$7.P$1 U$7.P$2 | LED1.C 16.75,61 15.5,61 14.5,60 BTN2.2 11.5,61.5 8.5,61.5 BTN2.3 8.3,59.85 2.4,59.85 1.7,59.15 SW1.SCREEN@3 1.35,58.8 1.35,56.1 0.75,55.5 0.75,46.8 1.35,46.2 SW1.SCREEN@1 0.7,45.2 0.7,34.2 1.05,33.85 1.1,33.85 1.8,33.15 C10.2 4.9,33 JTAG.8 5.05,32.8 v5.05,28 | 14.28,31.77 v12.5,30 | 25.2,49.3 24.1,48.2 C9.2 23.8,47.85 22.5,47.85 22.05,47.4 20.3,47.4 19.05,46.15 19.05,46.05 C7.2 | SW1.SCREEN@2 9.45,43.05 9.95,43.05 C1.2 | 25.2,49.3 25.05,49.5 v25.05,51 25.2,51.2 26.7,52.7 26.7,53.6 26.15,54.15 25.65,54.15 19.2,60.6 17.2,60.6 LED1.C | 33,60 BTN1.2 33.5,61.5 30.5,61.5 | BTN1.3 30.5,61.5 | 30.5,61.5 27.5,61.5 27,62 17.5,62 17,61.5 LED1.C | 13.8,21.95 13.95,21.85 | 13.85,21.95 13.6,21.95 | 14.3,21.8 14.09,21.81 | 14.3,21.65 14.18,21.86 | 14.5,21.7 14.3,21.84 14.45,21.65 | 14.95,21.85 v15.2,21.75 | 14,21.85 13.95,21.77 | 15.05,21.9 v15.2,21.75 | 15.05,21.9 15.05,21.75
  Bottom 0.5: v15.2,21.75 15.1,21.95 15.1,21.9 | 13.7,21.85 13.6,21.85 13.55,21.65 | 13.8,22 13.55,22 | 14.35,21.8 14.19,21.87 14.35,21.7 | 13.4,21.8 13.8,21.8 | 13.35,22.05 13.7,22.05 | 15.1,21.9 v15.2,21.75 | 15.1,21.9 15.1,21.75 | 14.4,21.65 14.3,21.87 | 14.95,21.95 v15.2,21.75 | 14.95,21.95 14.95,21.75 | 13.6,22.25 13.6,22.16 | 13.3,22 13.4,21.77 | 14.15,21.85 13.95,21.77 | v15.2,21.75 15,21.8 15,21.75 | 13.95,21.85 13.95,21.77 | 13.4,22.3 13.6,22.16 | U$10.4 13.5,22.35 13.6,22.16 | 13.5,22.2 13.6,22.16 | 14.9,21.75 v15.2,21.75 | 14.1,21.85 13.95,21.77 | v15.2,21.75 15.15,21.95 15.15,21.75 | 13.4,22.1 13.6,22.1
  pour Bottom: 0,60 4,62 4,65 39,65 39,54 29,54 29,0 0,0
  pour Top: 0,60 4,62 4,65 39,65 39,54 29,54 29,0 0,0
N$1
  Top 0.5: Q1.3 5.8,51.8 SW1.2 3.8,49.85 2.95,49 SW1.1
N$2
  Bottom 0.203: U$11.5 20.5,40.75 25,45.25 Q2.1 25.05,45.5 26,46.45 C9.1
N$3
  Bottom 0.203: U$11.6 21.35,40.25 22.1,41 24.6,41 Q2.2 25.05,40.5 26,39.55 C11.1
N$4  (via drill 0.3)
  Top 0.203: v7.95,35.85 7.95,34.85 8.2,34.6 v8.2,31.7
  Bottom 0.203: U$11.32 11.5,40.75 7.95,37.2 v7.95,35.85 | v8.2,31.7 8.2,30.05 2,23.85 R2.1
N$5  (via drill 0.3)
  Top 0.203: v6.65,35.85 6.65,35.2 v7.5,34.35
  Bottom 0.203: U$11.33 10.95,41.25 6.65,36.95 v6.65,35.85 | v7.5,34.35 8.9,32.95 8.9,30.15 5,26.25 R8.1
N$6  (via drill 0.3)
  Top 0.203: R9.1 17,55.25 v17.5,55.75
  Bottom 0.203: v17.5,55.75 17.5,56.75 LED1.A
N$7
  Bottom 0.203: U$11.34 10.85,41.75 9.8,40.7 5,40.7 JTAG.2
N$8  (via drill 0.3)
  Top 0.203: v18.75,42.9 18.75,50.9 R9.2
  Bottom 0.203: U$11.2 19.4,42.25 v18.75,42.9
N$13  (via drill 0.3)
  Top 0.203: v13.45,42.9 13.45,43.3 12.5,44.25 12,44.25 7.25,39.5 5,39.5 JTAG.3
  Bottom 0.203: U$11.37 13.25,43.1 v13.45,42.9
N$16  (via drill 0.3)
  Top 0.203: v12.25,43.55 11.9,43.55 6.55,38.2 JTAG.4
  Bottom 0.203: U$11.38 13.75,44.5 13.5,44.75 13,44.75 12.25,44 v12.25,43.55
N$17  (via drill 0.3)
  Top 0.203: v13.1,41.5 12.8,41.5 8.2,36.9 5,36.9 JTAG.5
  Bottom 0.203: U$11.39 14.25,42.65 v13.1,41.5
N$18  (via drill 0.3)
  Top 0.203: v14.25,45 14.25,41.15 11.8,38.7 11.8,34.45 13.7,32.55 13.7,26.7 12.55,25.55 11.05,25.55 8,28.6 7.05,28.6 2.75,32.9 2.75,35.35 3.2,35.8 4.85,35.8 JTAG.6
  Bottom 0.203: U$11.40 14.75,44.5 v14.25,45
POWER  (via drill 0.3)
  Top 0.4: U$13.1 23.3,55.65 22.75,56.2 22.75,56.35 | 22.75,56.35 22.75,57 23.3,57.55 U$13.3 | D1.K 25.8,18 v24.85,17.05 | v14,20.15 2.2,31.95 v2.2,44.15 | v22.3,56.35 22.75,56.35 | v13.25,58.45 8.45,58.45 SW1.3
  Bottom 0.4: v24.85,17.05 23.5,17.05 20.4,20.15 v14,20.15 | v2.2,44.15 2.2,44.35 4.3,46.45 4.3,48.65 5.2,49.55 5.2,52.8 SW1.3 | v22.3,56.35 20,56.35 17.9,58.45 v13.25,58.45
RESET  (via drill 0.3)
  Top 0.203: v12.5,36 v16.25,39.75
  Bottom 0.203: v16.25,39.75 U$11.7 | v12.5,36 10.35,36 9.4,35.05 6.15,35.05 5.5,34.4 5,34.4 JTAG.7 4.9,34.4 3.2,34.4 2.6,35 C10.1
SCL  (via drill 0.3)
  Top 0.203: v20.35,48.7 20.35,45.9 21.55,44.7 21.55,38.95 21.7,38.8 v21.7,36.4 | v19.75,31.65 19.75,31.1 22.5,28.35 v22.5,23.3
  Bottom 0.203: U$11.42 15.75,45.85 18.6,48.7 v20.35,48.7 | v21.7,36.4 21.7,35.85 22.2,35.35 22.2,34.1 v19.75,31.65 | R4.1 22.85,23.3 v22.5,23.3 22.3,23.3 21.5,24.1 16.9,24.1 16.8,24 U$10.14
SD-CS  (via drill 0.3)
  Top 0.203: v15.95,37.1 15.95,33.85 16.5,33.3 16.5,29.6 14.6,27.7 14.6,22.1 14.5,22 14.5,21.5 14.95,21.05 17.45,21.05 17.55,21.15 U$12.2
  Bottom 0.203: U$11.14 18.25,37.05 17.5,37.8 16.65,37.8 v15.95,37.1
SD-DI  (via drill 0.3)
  Top 0.203: v17.95,33.95 19.55,32.35 20.05,32.35 22.4,30 22.4,29.05 24.35,27.1 24.35,24.2 22.45,22.3 U$12.3
  Bottom 0.203: U$11.17 16.75,35.15 v17.95,33.95
SD-DO  (via drill 0.3)
  Top 0.203: v17.25,31.75 v17.25,37.1 | v17.8,27.75 18.75,26.8 U$12.7
  Bottom 0.203: v17.25,37.1 U$11.16 | v17.25,31.75 17.25,29.75 17.1,29.6 17.1,28.45 v17.8,27.75
SD-SCLK  (via drill 0.3)
  Top 0.203: v19.25,33.6 19.4,33.6 23.1,29.9 v23.1,29.3 | v21.55,28.35 21.55,26.35 19.7,24.5 U$12.5
  Bottom 0.203: U$11.15 17.75,35.1 v19.25,33.6 | v23.1,29.3 23,29.3 22.05,28.35 v21.55,28.35
SDA  (via drill 0.3)
  Top 0.203: v16.35,41.05 16.35,40.6 16.95,40 16.95,39.05 15.25,37.35 15.25,31.95 v15.8,31.4
  Bottom 0.203: U$11.43 16.25,41.15 v16.35,41.05 | v15.8,31.4 15.8,26.75 16.05,26.5 16.05,25.15 U$10.13 16.15,25.15 21.05,25.15 22.2,24 R5.1
USB+D  (via drill 0.3)
  Top 0.203: v5.85,6.55 6,6.55 6.55,6 X1.3
  Bottom 0.203: R8.2 5,9.3 5.85,8.45 v5.85,6.55
USB-D  (via drill 0.3)
  Top 0.203: v4.3,9.75 4.55,9.75 6.1,8.2 6.1,7.25 6.55,6.8 X1.2
  Bottom 0.203: R2.2 2,12.05 v4.3,9.75